# EAGLE schematic RX (EAGLE 9.5.0)
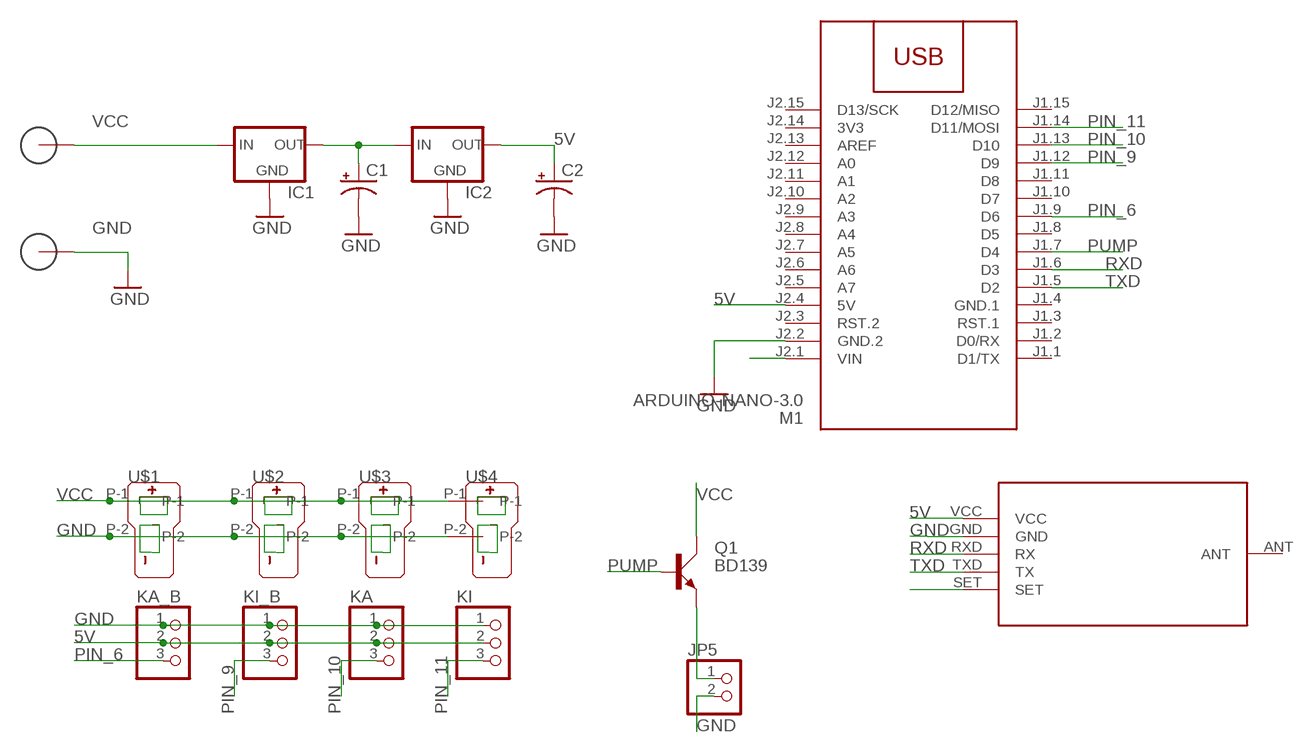
[diagram p0: schematic, sheet 1]

## Parts
C1  CPOL-USE2.5-7  [E2,5-7]
C2  CPOL-USE2.5-7  [E2,5-7]
H1  3MM_HOLE  [3MM_HOLE]
H2  3MM_HOLE  [3MM_HOLE]
IC1  78XXS  [78XXS]
IC2  78XXS  [78XXS]
JP5  PINHD-1X2  [1X02]
KA  PINHD-1X3  [1X03]
KA_B  PINHD-1X3  [1X03]
KI  PINHD-1X3  [1X03]
KI_B  PINHD-1X3  [1X03]
M1  ARDUINO-NANO-3.0  [ARDUINO-NANO-3.0]
Q1  BD139  [TO126AV]
U$1  T-PLUG_CONNECTOR  [T_PLUG_CONNECTOR]
U$2  T-PLUG_CONNECTOR  [T_PLUG_CONNECTOR]
U$3  T-PLUG_CONNECTOR  [T_PLUG_CONNECTOR]
U$4  T-PLUG_CONNECTOR  [T_PLUG_CONNECTOR]
U$5  HC-12_FOOTPRINT  [HC-12_FOOTPRINT]

## Nets
5V: C2.+ IC2.OUT KA.2 KA_B.2 KI.2 KI_B.2 M1.J2.4(5V) U$5.VCC
GND: C1.- C2.- H2.P$1(GND) H2.P$2(GND) H2.P$3(GND) H2.P$4(GND) H2.P$5(GND) H2.P$6(GND) H2.P$7(GND) H2.P$8(GND) H2.P$9(GND) IC1.GND IC2.GND JP5.2 KA.1 KA_B.1 KI.1 KI_B.1 M1.J2.2(GND.2) U$1.P-2 U$2.P-2 U$3.P-2 U$4.P-2 U$5.GND
N$2: C1.+ IC1.OUT IC2.IN
N$4: M1.J2.1(VIN)
N$5: JP5.1 Q1.E
N$8: U$5.SET
PIN_6: KA_B.3 M1.J1.9(D6)
PIN_9: KI_B.3 M1.J1.12(D9)
PIN_10: KA.3 M1.J1.13(D10)
PIN_11: KI.3 M1.J1.14(D11/MOSI)
PUMP: M1.J1.7(D4) Q1.B
RXD: M1.J1.6(D3) U$5.RXD(RX)
TXD: M1.J1.5(D2) U$5.TXD(TX)
VCC: H1.P$1(GND) H1.P$2(GND) H1.P$3(GND) H1.P$4(GND) H1.P$5(GND) H1.P$6(GND) H1.P$7(GND) H1.P$8(GND) H1.P$9(GND) IC1.IN Q1.C U$1.P-1 U$2.P-1 U$3.P-1 U$4.P-1
Unconnected: M1.J1.1(D1/TX) M1.J1.2(D0/RX) M1.J1.3(RST.1) M1.J1.8(D5) M1.J1.10(D7) M1.J1.11(D8) M1.J1.15(D12/MISO) M1.J2.3(RST.2) M1.J2.5(A7) M1.J2.6(A6) M1.J2.7(A5) M1.J2.8(A4) M1.J2.9(A3) M1.J2.10(A2) M1.J2.11(A1) M1.J2.12(A0) M1.J2.13(AREF) M1.J2.15(D13/SCK) U$5.ANT

## Power pins joined to a net without a drawn wire
3V3: M1.J2.14(3V3)
GND.1: M1.J1.4(GND.1)

## Library data of the parts
C1 C2 = rcl:CPOL-US: POLARIZED CAPACITOR, American symbol; SPICEPREFIX: C
H1 H2 = 3mm_special_hole:3MM_HOLE: Cool looking 3mm hole with ground connection
IC1 IC2 = v-reg:78XXS: VOLTAGE REGULATOR
JP5 = pinhead:PINHD-1X2: PIN HEADER
KA KA_B KI KI_B = pinhead:PINHD-1X3: PIN HEADER
M1 = diy-modules:ARDUINO-NANO-3.0: Arduino Nano 3.0 and compatible devices More details available here: https://www.arduino.cc/en/Main/ArduinoBoardNano Click here to find device on ebay.com <http://www.ebay.com/sch/arduino+nano>
Q1 = transistor-power:BD139: NPN TRANSISTOR
U$1-U$4 = con-T-plug:T-PLUG_CONNECTOR
U$5 = hc12_433mhz:HC-12_FOOTPRINT: HC-12 433MHz module footprint MCHFIX is for mechanical fix pin which is NC but on this file connected to GND https://github.com/meendiz/hc-12_si4463/